# Altium schematic sheet ST_LINK_V2-1.SCHDOC: ST-LINK/V2-1
size A4; DocumentNumber: MB1246; Revision: B.1; SheetNumber: 15; SheetTotal: 17; Project: STM32H7xxI-EVAL
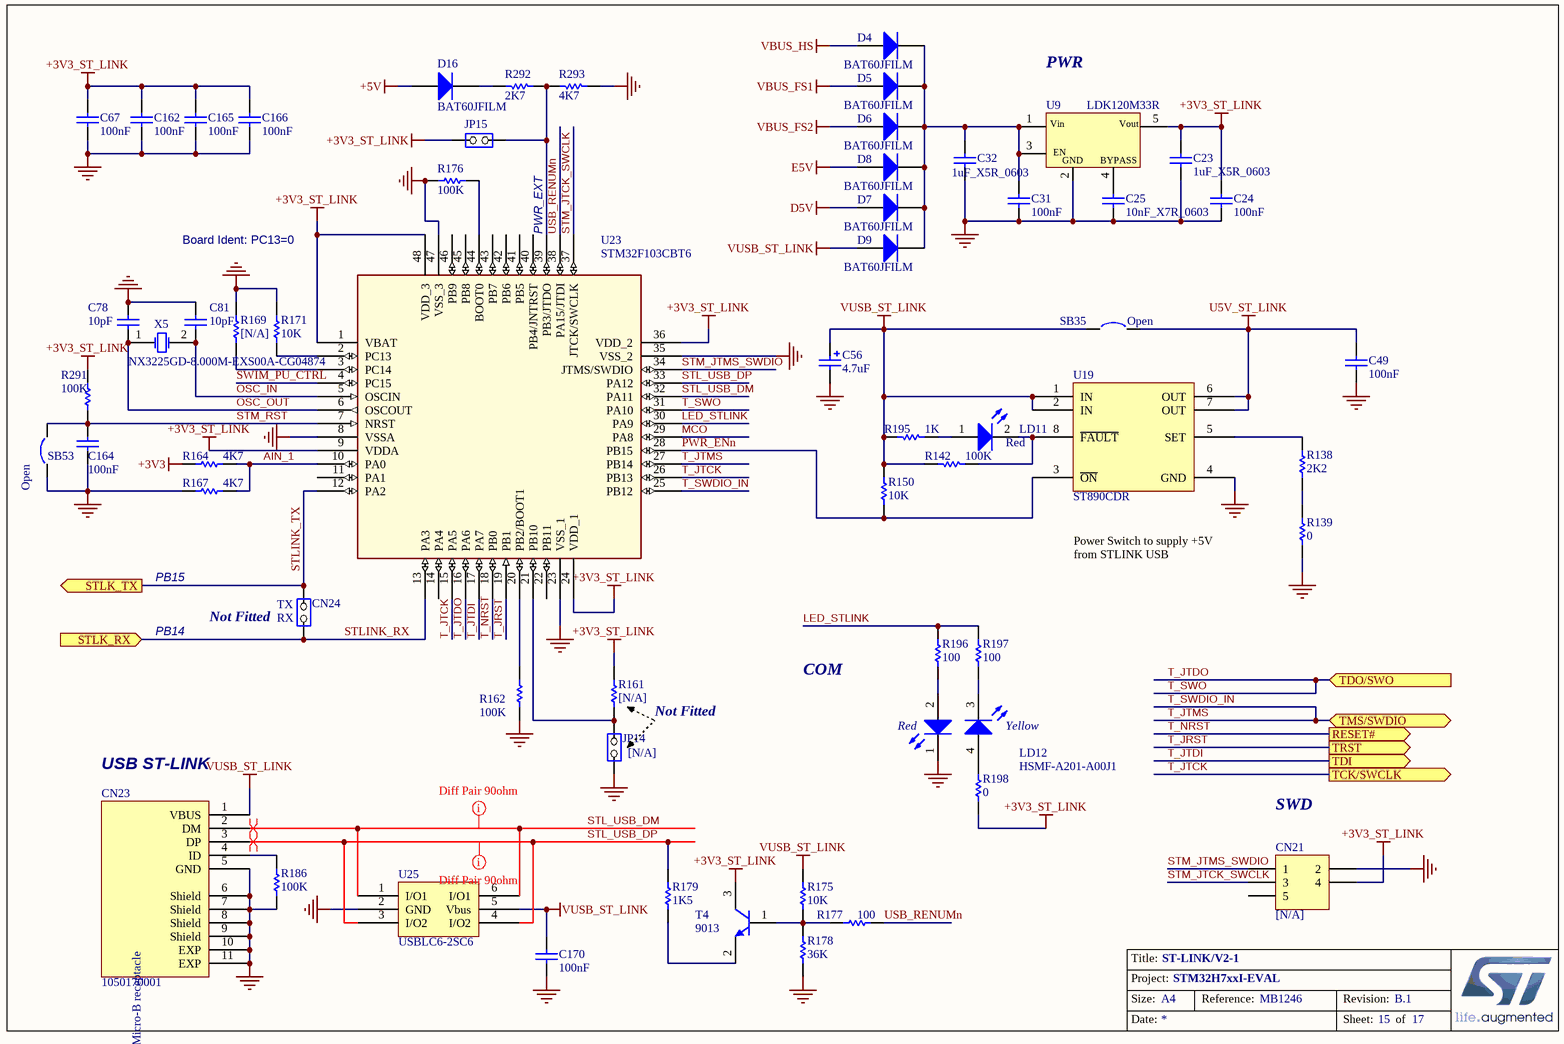
[diagram p0: ST_LINK_V2-1.SCHDOC]

## Parts
C23  1uF_X5R_0603  [0603C]
C24  100nF  [0603C]
C25  10nF_X7R_0603  [0603C]
C31  100nF  [0603C]
C32  1uF_X5R_0603  [0603C]
C49  100nF  [0603C]
C56  4.7uF  [TAN-A]
C67  100nF  [0603C]
C78  10pF  [0603C]
C81  10pF  [0603C]
C162  100nF  [0603C]
C164  100nF  [0603C]
C165  100nF  [0603C]
C166  100nF  [0603C]
C170  100nF  [0603C]
CN21  [N/A]  [HDR_2X3-1_2R54-6]
CN23  1050170001  [MICRO_USB_B_105017]
CN24  (no value)  [SIP2]
D4  BAT60JFILM  [SOD-323]
D5  BAT60JFILM  [SOD-323]
D6  BAT60JFILM  [SOD-323]
D7  BAT60JFILM  [SOD-323]
D8  BAT60JFILM  [SOD-323]
D9  BAT60JFILM  [SOD-323]
D16  BAT60JFILM  [SOD-323]
JP14  [N/A]  [SIP2]
JP15  (no value)  [SIP2]
LD11  Red  [0603D]
LD12  HSMF-A201-A00J1  [LED2_3528]
R138  2K2  [0402R]
R139  0  [0603R]
R142  100K  [0603R]
R150  10K  [0402R]
R161  [N/A]  [0603R]
R162  100K  [0603R]
R164  4K7  [0603R]
R167  4K7  [0603R]
R169  [N/A]  [0603R]
R171  10K  [0603R]
R175  10K  [0603R]
R176  100K  [0603R]
R177  100  [0603R]
R178  36K  [0603R]
R179  1K5  [0603R]
R186  100K  [0603R]
R195  1K  [0603R]
R196  100  [0603R]
R197  100  [0603R]
R198  0  [0603R]
R291  100K  [0603R]
R292  2K7  [0603R]
R293  4K7  [0603R]
SB35  Open  [SB_0603]
SB53  Open  [SB_0603]
T4  9013  [SOT-23]
U9  LDK120M33R  [SOT23-5]
U19  ST890CDR  [SOIC8_1R27_4R9X6]
U23  STM32F103CBT6  [LQFP48_0R5_9X9]
U25  USBLC6-2SC6  [SOT23-6L]
X5  NX3225GD-8.000M-EXS00A-CG04874  [XTAL_2SM_3R2X2R5_H1]

## Ports
RESET# (out), STLK_RX (in), STLK_TX (out), TCK/SWCLK (out), TDI (out), TDO/SWO (in), TMS/SWDIO (bidir), TRST (out)

## Nets
+3V3: R164.1
+3V3_ST_LINK: C23.1 C24.2 C67.2 C162.2 C165.2 C166.2 CN21.4 JP15.1(COMMON) R161.1 R198.2 R291.2 T4.3(C) U9.5(Vout) U23.1(VBAT) U23.9(VDDA) U23.24(VDD_1) U23.36(VDD_2) U23.48(VDD_3)
+5V: D16.1(A)
D5V: D7.1(A)
E5V: D8.1(A)
GND: C23.2 C24.1 C25.1 C31.1 C32.1 C49.1 C56.2 C67.1 C78.2 C81.2 C162.1 C164.1 C165.1 C166.1 C170.1 CN21.2 CN23.5(GND) CN23.6(Shield) CN23.7(Shield) CN23.8(Shield) CN23.9(Shield) CN23.10(EXP) CN23.11(EXP) JP14.1(COMMON) LD12.1(RED_cathode) R139.1 R162.1 R167.1 R169.1 R171.1 R176.1 R178.1 R186.2 R293.2 SB53.1 U9.2(GND) U19.4(GND) U23.8(VSSA) U23.23(VSS_1) U23.35(VSS_2) U23.47(VSS_3) U25.2(GND)
U5V_ST_LINK: C49.2 SB35.2 U19.6(OUT) U19.7(OUT)
VBUS_FS1: D5.1(A)
VBUS_FS2: D6.1(A)
VBUS_HS: D4.1(A)
VUSB_ST_LINK: C56.1 C170.2 CN23.1(VBUS) D9.1(A) R142.1 R150.1 R175.2 R195.1 SB35.1 U19.1(IN) U19.2(IN) U25.5(Vbus)
AIN_1: R164.2 R167.2 U23.10(PA0)
LED_STLINK: R196.1 R197.1 U23.30(PA9)
MCO: U23.29(PA8)
OSC_IN: C81.1 U23.5(OSCIN) X5.2(OSC2)
OSC_OUT: C78.1 U23.6(OSCOUT) X5.1(OSC1)
PWR_ENn: R150.2 U19.3(~{ON}) U23.28(PB15)
STL_USB_DM: CN23.2(DM) U23.32(PA11) U25.1(I/O1) U25.6(I/O1)
STL_USB_DP: CN23.3(DP) R179.1 U23.33(PA12) U25.3(I/O2) U25.4(I/O2)
STLINK_RX: CN24.1(COMMON) U23.13(PA3) ; port STLK_RX
STLINK_TX: CN24.2(NO) U23.12(PA2) ; port STLK_TX
STM_JTCK_SWCLK: CN21.3 U23.37(JTCK/SWCLK)
STM_JTMS_SWDIO: CN21.1 U23.34(JTMS/SWDIO)
STM_RST: C164.2 R291.1 SB53.2 U23.7(NRST)
SWIM_PU_CTRL: U23.4(PC15)
T_JRST: U23.19(PB1) ; port TRST
T_JTCK: U23.15(PA5) U23.26(PB13) ; port TCK/SWCLK
T_JTDI: U23.17(PA7) ; port TDI
T_JTDO: U23.16(PA6) U23.31(PA10) ; port TDO/SWO  [also labelled T_SWO]
T_JTMS: U23.25(PB12) U23.27(PB14) ; port TMS/SWDIO  [also labelled T_SWDIO_IN]
T_NRST: U23.18(PB0) ; port RESET#
USB_RENUMn: R177.2 U23.38(PA15/JTDI)
NetC25_2: C25.2 U9.4(BYPASS)
NetC31_2: C31.2 C32.2 D4.2(K) D5.2(K) D6.2(K) D7.2(K) D8.2(K) D9.2(K) U9.1(Vin) U9.3(CE)
NetCN23_4: CN23.4(ID) R186.1
NetD16_2: D16.2(K) R292.1
NetJP14_2: JP14.2(NO) R161.2 U23.21(PB10)
NetJP15_2: JP15.2(NO) R292.2 R293.1 U23.39(PB3/JTDO)
NetLD11_1: LD11.1(A) R195.2
NetLD11_2: LD11.2(K) R142.2 U19.8(~{FAULT})
NetLD12_2: LD12.2(Red_anode) R196.2
NetLD12_3: LD12.3(YellowGreen_cathode) R197.2
NetLD12_4: LD12.4(YellowGreen_anode) R198.1
NetR138_1: R138.1 R139.2
NetR138_2: R138.2 U19.5(SET)
NetR162_2: R162.2 U23.20(PB2/BOOT1)
NetR169_2: R169.2 U23.3(PC14)
NetR171_2: R171.2 U23.2(PC13)
NetR175_1: R175.1 R177.1 R178.2 T4.1(B)
NetR176_2: R176.2 U23.44(BOOT0)
NetR179_2: R179.2 T4.2(E)

Not connected (* = marked no-connect by the designer): CN21 5; U23 11(PA1) 14(PA4) 22(PB11) 40(PB4/JNTRST) 41(PB5) 42(PB6) 43(PB7) 45(PB8) 46(PB9)

## Layout directives
differential pair: (no net found under the mark)
mark named Diff Pair 90ohm: STL_USB_DM, STL_USB_DP

## Notes on the sheet
- PWR
- Board Ident: PC13=0
- (near U23) PWR_EXT
- PB15
- Power Switch to supply +5V from STLINK USB
- PB14
- (near CN24) Not Fitted
- (near CN24) TX
- (near CN24) RX
- Not Fitted
- COM
- (near CN23) USB ST-LINK
- SWD
- Title:
- Project:
- Size:
- Date:
- A4
- Reference:
- Sheet:
- Revision:
- of
- (in symbol 1050170001) USB_Micro-B receptacle
- (in symbol HSMF-A201-A00J1) Red; Yellow
- (in symbol LDK120M33R) EN

## Library data of the parts
C23 C32 = CAP SMD 0603  X5R 1µF 25V 10%: 0603  X5R 1µF; Rated voltage: 25V; Tolerance: 10%; Manufacturer: *; Manufacturer P/N: *; Order code Farnell: 1288202RL; Value: 1µF; Power: *; Technology: X5R; Temperature  Factor: *; Temperature Max: +125°C; Temperature Min: -55°C; STS Code: *
C24 C31 C49 C67 C162 C164-C166 C170 = Capacitor_ST: Capacitor 0402 / 0603 / 0805; Revision: July-2002: Re-released for DXP Platform.; Value: 100nF
C25 = CAP SMD 0603  X7R 10000PF 50V 10%: 0603  X7R 10NF; Order code RS: 2040779; Rated voltage: 50V; Tolerance: 10%; Order code Farnell: 7569548RL; Value: 10NF; Power: *; Technology: X7R; Temperature Factor: *; Temperature Min: -55°C; Temperature Max: +125°C; STS Code: *
C56 = Cap Pol1: Polarized Capacitor (Radial); Value: 100pF; Ordered by: Subcon; Published: 8-Jun-2000; Revision: July-2002: Re-released for DXP Platform.; Publisher: Altium Limited
C78 C81 = Capacitor_ST: Capacitor 0402 / 0603 / 0805; Value: 100nF; Revision: July-2002: Re-released for DXP Platform.
CN21 = Header 3X2: Header, 3-Pin, Dual row; Revision: 17-Jul-2002: Re-released for DXP Platform.; Publisher: Altium Limited
CN23 = 1050170001: Silkscreen: USB
CN24 = JP2: Fitted: NO
D4-D9 = BAT60JFILM: Manuf_1: STM; Provided: ST; ECCN_US/EU: EAR99/NEC; Revision: July-2002: Re-released for DXP Platform.; Order: BAT60JFILM; Manuf_Part_1: BAT60JFILM; Distrib: ST
D16 = Diode: Default Diode; Code - JEDEC: DO-214-AB; Ordered by: STM; ECCN_US/EU: EAR99/NEC; Published: 8-Jun-2000; Revision: July-2002: Re-released for DXP Platform.; Publisher: Altium Limited
JP14 = JP2
JP15 = JP2: Ordered by: Subcon; Silkscreen: Pwr_ext
LD11 = LED2: Typical RED, GREEN, YELLOW, AMBER GaAs LED; Published: 8-Jun-2000; Revision: July-2002: Re-released for DXP Platform.; Publisher: Altium Limited
R138 R162 R176 R177 R179 R186 R291 = Resistor_ST: Resistor 0402 / 0603 / 0805; Description: Resistor 0402 or 0603 or 0805; Value: 10K
R139 R161 R175 R178 R196-R198 R292 R293 = Res1: Resistor; Value: 1K; Published: 8-Jun-2000; Revision: July-2002: Re-released for DXP Platform.; Publisher: Altium Limited
R142 = Res1: Resistor; Value: 1K; Ordered by: Subcon; Published: 8-Jun-2000; Revision: July-2002: Re-released for DXP Platform.; Publisher: Altium Limited
R150 R171 = Resistor_ST: Resistor 0402 / 0603 / 0805; Description: Resistor 0402 or 0603 or 0805; Value: 10K
R164 R167 R169 = Resistor_ST: Resistor 0402 / 0603 / 0805; Description: Resistor 0402 or 0603 or 0805; Value: 10K; Fitted: NO
R195 = Res1: Resistor; Ordered by: Subcon; Published: 8-Jun-2000; Revision: July-2002: Re-released for DXP Platform.; Publisher: Altium Limited; Value: 1K
SB35 SB53 = Circuit Breaker: Published: 24-Mar-1999; Revision: July-2002: Re-released for DXP Platform.; Publisher: Altium Limited
T4 = NPN: NPN Bipolar Transistor; Code - JEDEC: TO-226-AA; Published: 8-Jun-2000; Revision: July-2002: Re-released for DXP Platform.; Publisher: Altium Limited
U9 = LDK120M33R: 200 mA low quiescent current very low noise LDO; Manuf_1: STM; Manuf_Part_1: LD3985M33R; Provided: ST; Description: Ultra low drop-low noise BiCMOS voltage, regulators low ESR capacitors compatible; Ref St: 9176161; ECCN_US/EU: EAR99/NEC; Distrib: ST; Order: LD3985M33R
U23 = STM32F103CBT6: Medium-density performance line ARM-based 32-bit MCU with 64KB Flash; Manuf_Part_1: STM32F103C8T6; Manuf_1: STM; Ref St: 9175981; Provided: ST; ECCN_US/EU: 3A991A2/NEC; Footprint: QFP48 7X7; Distrib: ST; Order: STM32F103C8T6
X5 = XTAL: Crystal Oscillator; Published: 8-Jun-2000; LatestRevisionDate: 17-Jul-2002; LatestRevisionNote: Re-released for DXP Platform.; PackageReference: R38; Publisher: Altium Limited